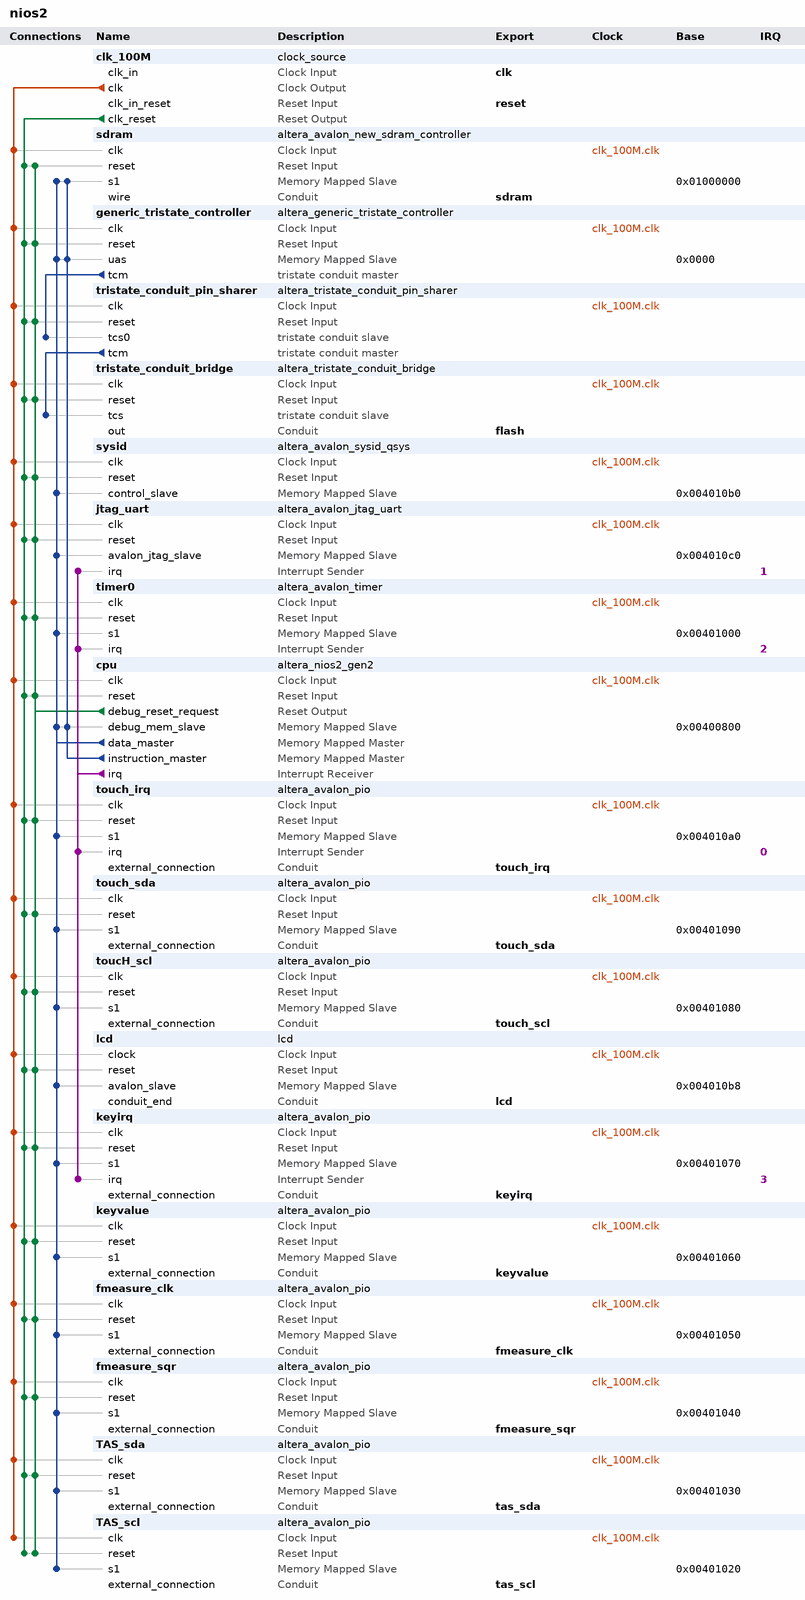
[diagram p0: system contents]
# Platform Designer (Qsys) system nios2, Cyclone IV E EP4CE40F23C8
# Parameters at their usual value, and those the tool derives, are not listed.
package require -exact qsys 17.0
create_system nios2
set_project_property DEVICE_FAMILY {Cyclone IV E}
set_project_property DEVICE EP4CE40F23C8

add_instance clk_100M clock_source 17.0
set_instance_parameter_value clk_100M clockFrequency 100000000

add_instance sdram altera_avalon_new_sdram_controller 17.0
set_instance_parameter_value sdram TAC 5.5
set_instance_parameter_value sdram TRCD 20.0
set_instance_parameter_value sdram TRP 20.0
set_instance_parameter_value sdram casLatency 3
set_instance_parameter_value sdram columnWidth 8
set_instance_parameter_value sdram dataWidth 16
set_instance_parameter_value sdram generateSimulationModel false
set_instance_parameter_value sdram model single_Micron_MT48LC4M32B2_7_chip
set_instance_parameter_value sdram numberOfBanks 4
set_instance_parameter_value sdram numberOfChipSelects 1
set_instance_parameter_value sdram powerUpDelay 100.0
set_instance_parameter_value sdram refreshPeriod 15.625
set_instance_parameter_value sdram rowWidth 12

add_instance generic_tristate_controller altera_generic_tristate_controller 17.0
set_instance_parameter_value generic_tristate_controller ACTIVE_LOW_BEGINTRANSFER 0
set_instance_parameter_value generic_tristate_controller ACTIVE_LOW_BYTEENABLE 0
set_instance_parameter_value generic_tristate_controller ACTIVE_LOW_OUTPUTENABLE 0
set_instance_parameter_value generic_tristate_controller ACTIVE_LOW_READ 1
set_instance_parameter_value generic_tristate_controller CHIPSELECT_THROUGH_READLATENCY 0
set_instance_parameter_value generic_tristate_controller INTERFACE_ASSIGNMENT_KEYS embeddedsw.configuration.isFlash,embeddedsw.configuration.isMemoryDevice,embeddedsw.configuration.isNonVolatileStorage
set_instance_parameter_value generic_tristate_controller INTERFACE_ASSIGNMENT_VALUES 1,1,1
set_instance_parameter_value generic_tristate_controller MODULE_ASSIGNMENT_KEYS embeddedsw.configuration.hwClassnameDriverSupportList,embeddedsw.configuration.hwClassnameDriverSupportDefault,embeddedsw.CMacro.SETUP_VALUE,embeddedsw.CMacro.WAIT_VALUE,embeddedsw.CMacro.HOLD_VALUE,embeddedsw.CMacro.TIMING_UNITS,embeddedsw.CMacro.SIZE,embeddedsw.memoryInfo.MEM_INIT_DATA_WIDTH,embeddedsw.memoryInfo.HAS_BYTE_LANE,embeddedsw.memoryInfo.IS_FLASH,embeddedsw.memoryInfo.GENERATE_DAT_SYM,embeddedsw.memoryInfo.GENERATE_FLASH,embeddedsw.memoryInfo.DAT_SYM_INSTALL_DIR,embeddedsw.memoryInfo.FLASH_INSTALL_DIR
set_instance_parameter_value generic_tristate_controller MODULE_ASSIGNMENT_VALUES altera_avalon_lan91c111:altera_avalon_cfi_flash,altera_avalon_cfi_flash,70,160,70,ns,4194304u,8,0,1,1,1,SIM_DIR,APP_DIR
set_instance_parameter_value generic_tristate_controller TCM_ADDRESS_W 22
set_instance_parameter_value generic_tristate_controller TCM_BYTEENABLE_W 1
set_instance_parameter_value generic_tristate_controller TCM_DATA_HOLD 70
set_instance_parameter_value generic_tristate_controller TCM_DATA_W 8
set_instance_parameter_value generic_tristate_controller TCM_MAX_PENDING_READ_TRANSACTIONS 3
set_instance_parameter_value generic_tristate_controller TCM_READLATENCY 2
set_instance_parameter_value generic_tristate_controller TCM_READ_WAIT 160
set_instance_parameter_value generic_tristate_controller TCM_SETUP_WAIT 70
set_instance_parameter_value generic_tristate_controller TCM_SYMBOLS_PER_WORD 1
set_instance_parameter_value generic_tristate_controller TCM_TIMING_UNITS 0
set_instance_parameter_value generic_tristate_controller TCM_TURNAROUND_TIME 2
set_instance_parameter_value generic_tristate_controller TCM_WRITE_WAIT 160
set_instance_parameter_value generic_tristate_controller USE_BEGINTRANSFER 0
set_instance_parameter_value generic_tristate_controller USE_BYTEENABLE 0
set_instance_parameter_value generic_tristate_controller USE_OUTPUTENABLE 0
set_instance_parameter_value generic_tristate_controller USE_READ 1

add_instance tristate_conduit_pin_sharer altera_tristate_conduit_pin_sharer 17.0
set_instance_parameter_value tristate_conduit_pin_sharer MODULE_ORIGIN_LIST generic_tristate_controller.tcm,generic_tristate_controller.tcm,generic_tristate_controller.tcm,generic_tristate_controller.tcm,generic_tristate_controller.tcm
set_instance_parameter_value tristate_conduit_pin_sharer NUM_INTERFACES 1

add_instance tristate_conduit_bridge altera_tristate_conduit_bridge 17.0

add_instance sysid altera_avalon_sysid_qsys 17.0
set_instance_parameter_value sysid id 0

add_instance jtag_uart altera_avalon_jtag_uart 17.0
set_instance_parameter_value jtag_uart simInteractiveOptions NO_INTERACTIVE_WINDOWS

add_instance timer0 altera_avalon_timer 17.0
set_instance_parameter_value timer0 fixedPeriod true
set_instance_parameter_value timer0 period 10
set_instance_parameter_value timer0 periodUnits MSEC
set_instance_parameter_value timer0 snapshot false

add_instance cpu altera_nios2_gen2 17.0
set_instance_parameter_value cpu dcache_size 0
set_instance_parameter_value cpu dividerType srt2
set_instance_parameter_value cpu exceptionSlave sdram.s1
set_instance_parameter_value cpu icache_size 8192
set_instance_parameter_value cpu impl Fast
set_instance_parameter_value cpu resetSlave generic_tristate_controller.uas

add_instance touch_irq altera_avalon_pio 17.0
set_instance_parameter_value touch_irq captureEdge true
set_instance_parameter_value touch_irq direction Input
set_instance_parameter_value touch_irq generateIRQ true
set_instance_parameter_value touch_irq irqType EDGE
set_instance_parameter_value touch_irq width 1

add_instance touch_sda altera_avalon_pio 17.0
set_instance_parameter_value touch_sda direction Bidir
set_instance_parameter_value touch_sda width 1

add_instance toucH_scl altera_avalon_pio 17.0
set_instance_parameter_value toucH_scl direction Output
set_instance_parameter_value toucH_scl width 1

add_instance lcd lcd 1.0

add_instance keyirq altera_avalon_pio 17.0
set_instance_parameter_value keyirq captureEdge true
set_instance_parameter_value keyirq direction Input
set_instance_parameter_value keyirq generateIRQ true
set_instance_parameter_value keyirq irqType EDGE
set_instance_parameter_value keyirq width 3

add_instance keyvalue altera_avalon_pio 17.0
set_instance_parameter_value keyvalue direction Input
set_instance_parameter_value keyvalue width 3

add_instance fmeasure_clk altera_avalon_pio 17.0
set_instance_parameter_value fmeasure_clk direction Input
set_instance_parameter_value fmeasure_clk width 32

add_instance fmeasure_sqr altera_avalon_pio 17.0
set_instance_parameter_value fmeasure_sqr direction Input
set_instance_parameter_value fmeasure_sqr width 32

add_instance TAS_sda altera_avalon_pio 17.0
set_instance_parameter_value TAS_sda direction Bidir
set_instance_parameter_value TAS_sda width 1

add_instance TAS_scl altera_avalon_pio 17.0
set_instance_parameter_value TAS_scl direction Output
set_instance_parameter_value TAS_scl width 1

# connections
add_connection clk_100M.clk cpu.clk clock
add_connection clk_100M.clk fmeasure_clk.clk clock
add_connection clk_100M.clk fmeasure_sqr.clk clock
add_connection clk_100M.clk generic_tristate_controller.clk clock
add_connection clk_100M.clk jtag_uart.clk clock
add_connection clk_100M.clk keyirq.clk clock
add_connection clk_100M.clk keyvalue.clk clock
add_connection clk_100M.clk lcd.clock clock
add_connection clk_100M.clk sdram.clk clock
add_connection clk_100M.clk sysid.clk clock
add_connection clk_100M.clk TAS_scl.clk clock
add_connection clk_100M.clk TAS_sda.clk clock
add_connection clk_100M.clk timer0.clk clock
add_connection clk_100M.clk touch_irq.clk clock
add_connection clk_100M.clk toucH_scl.clk clock
add_connection clk_100M.clk touch_sda.clk clock
add_connection clk_100M.clk tristate_conduit_bridge.clk clock
add_connection clk_100M.clk tristate_conduit_pin_sharer.clk clock
add_connection clk_100M.clk_reset cpu.reset reset
add_connection clk_100M.clk_reset fmeasure_clk.reset reset
add_connection clk_100M.clk_reset fmeasure_sqr.reset reset
add_connection clk_100M.clk_reset generic_tristate_controller.reset reset
add_connection clk_100M.clk_reset jtag_uart.reset reset
add_connection clk_100M.clk_reset keyirq.reset reset
add_connection clk_100M.clk_reset keyvalue.reset reset
add_connection clk_100M.clk_reset lcd.reset reset
add_connection clk_100M.clk_reset sdram.reset reset
add_connection clk_100M.clk_reset sysid.reset reset
add_connection clk_100M.clk_reset TAS_scl.reset reset
add_connection clk_100M.clk_reset TAS_sda.reset reset
add_connection clk_100M.clk_reset timer0.reset reset
add_connection clk_100M.clk_reset touch_irq.reset reset
add_connection clk_100M.clk_reset toucH_scl.reset reset
add_connection clk_100M.clk_reset touch_sda.reset reset
add_connection clk_100M.clk_reset tristate_conduit_bridge.reset reset
add_connection clk_100M.clk_reset tristate_conduit_pin_sharer.reset reset
add_connection cpu.debug_reset_request cpu.reset reset
add_connection cpu.debug_reset_request fmeasure_clk.reset reset
add_connection cpu.debug_reset_request fmeasure_sqr.reset reset
add_connection cpu.debug_reset_request generic_tristate_controller.reset reset
add_connection cpu.debug_reset_request jtag_uart.reset reset
add_connection cpu.debug_reset_request keyirq.reset reset
add_connection cpu.debug_reset_request keyvalue.reset reset
add_connection cpu.debug_reset_request lcd.reset reset
add_connection cpu.debug_reset_request sdram.reset reset
add_connection cpu.debug_reset_request sysid.reset reset
add_connection cpu.debug_reset_request TAS_scl.reset reset
add_connection cpu.debug_reset_request TAS_sda.reset reset
add_connection cpu.debug_reset_request timer0.reset reset
add_connection cpu.debug_reset_request touch_irq.reset reset
add_connection cpu.debug_reset_request toucH_scl.reset reset
add_connection cpu.debug_reset_request touch_sda.reset reset
add_connection cpu.debug_reset_request tristate_conduit_bridge.reset reset
add_connection cpu.debug_reset_request tristate_conduit_pin_sharer.reset reset
add_connection cpu.data_master cpu.debug_mem_slave avalon
set_connection_parameter_value cpu.data_master/cpu.debug_mem_slave baseAddress 0x00400800
add_connection cpu.data_master fmeasure_clk.s1 avalon
set_connection_parameter_value cpu.data_master/fmeasure_clk.s1 baseAddress 0x00401050
add_connection cpu.data_master fmeasure_sqr.s1 avalon
set_connection_parameter_value cpu.data_master/fmeasure_sqr.s1 baseAddress 0x00401040
add_connection cpu.data_master generic_tristate_controller.uas avalon
set_connection_parameter_value cpu.data_master/generic_tristate_controller.uas baseAddress 0x0000
add_connection cpu.data_master jtag_uart.avalon_jtag_slave avalon
set_connection_parameter_value cpu.data_master/jtag_uart.avalon_jtag_slave baseAddress 0x004010c0
add_connection cpu.data_master keyirq.s1 avalon
set_connection_parameter_value cpu.data_master/keyirq.s1 baseAddress 0x00401070
add_connection cpu.data_master keyvalue.s1 avalon
set_connection_parameter_value cpu.data_master/keyvalue.s1 baseAddress 0x00401060
add_connection cpu.data_master lcd.avalon_slave avalon
set_connection_parameter_value cpu.data_master/lcd.avalon_slave baseAddress 0x004010b8
add_connection cpu.data_master sdram.s1 avalon
set_connection_parameter_value cpu.data_master/sdram.s1 baseAddress 0x01000000
add_connection cpu.data_master sysid.control_slave avalon
set_connection_parameter_value cpu.data_master/sysid.control_slave baseAddress 0x004010b0
add_connection cpu.data_master TAS_scl.s1 avalon
set_connection_parameter_value cpu.data_master/TAS_scl.s1 baseAddress 0x00401020
add_connection cpu.data_master TAS_sda.s1 avalon
set_connection_parameter_value cpu.data_master/TAS_sda.s1 baseAddress 0x00401030
add_connection cpu.data_master timer0.s1 avalon
set_connection_parameter_value cpu.data_master/timer0.s1 baseAddress 0x00401000
add_connection cpu.data_master touch_irq.s1 avalon
set_connection_parameter_value cpu.data_master/touch_irq.s1 baseAddress 0x004010a0
add_connection cpu.data_master toucH_scl.s1 avalon
set_connection_parameter_value cpu.data_master/toucH_scl.s1 baseAddress 0x00401080
add_connection cpu.data_master touch_sda.s1 avalon
set_connection_parameter_value cpu.data_master/touch_sda.s1 baseAddress 0x00401090
add_connection cpu.instruction_master cpu.debug_mem_slave avalon
set_connection_parameter_value cpu.instruction_master/cpu.debug_mem_slave baseAddress 0x00400800
add_connection cpu.instruction_master generic_tristate_controller.uas avalon
set_connection_parameter_value cpu.instruction_master/generic_tristate_controller.uas baseAddress 0x0000
add_connection cpu.instruction_master sdram.s1 avalon
set_connection_parameter_value cpu.instruction_master/sdram.s1 baseAddress 0x01000000
add_connection cpu.irq jtag_uart.irq interrupt
set_connection_parameter_value cpu.irq/jtag_uart.irq irqNumber 1
add_connection cpu.irq keyirq.irq interrupt
set_connection_parameter_value cpu.irq/keyirq.irq irqNumber 3
add_connection cpu.irq timer0.irq interrupt
set_connection_parameter_value cpu.irq/timer0.irq irqNumber 2
add_connection cpu.irq touch_irq.irq interrupt
set_connection_parameter_value cpu.irq/touch_irq.irq irqNumber 0
add_connection generic_tristate_controller.tcm tristate_conduit_pin_sharer.tcs0 tristate_conduit
add_connection tristate_conduit_pin_sharer.tcm tristate_conduit_bridge.tcs tristate_conduit

# exported interfaces
add_interface clk clock sink
set_interface_property clk EXPORT_OF clk_100M.clk_in
add_interface flash conduit end
set_interface_property flash EXPORT_OF tristate_conduit_bridge.out
add_interface fmeasure_clk conduit end
set_interface_property fmeasure_clk EXPORT_OF fmeasure_clk.external_connection
add_interface fmeasure_sqr conduit end
set_interface_property fmeasure_sqr EXPORT_OF fmeasure_sqr.external_connection
add_interface keyirq conduit end
set_interface_property keyirq EXPORT_OF keyirq.external_connection
add_interface keyvalue conduit end
set_interface_property keyvalue EXPORT_OF keyvalue.external_connection
add_interface lcd conduit end
set_interface_property lcd EXPORT_OF lcd.conduit_end
add_interface reset reset sink
set_interface_property reset EXPORT_OF clk_100M.clk_in_reset
add_interface sdram conduit end
set_interface_property sdram EXPORT_OF sdram.wire
add_interface tas_scl conduit end
set_interface_property tas_scl EXPORT_OF TAS_scl.external_connection
add_interface tas_sda conduit end
set_interface_property tas_sda EXPORT_OF TAS_sda.external_connection
add_interface touch_irq conduit end
set_interface_property touch_irq EXPORT_OF touch_irq.external_connection
add_interface touch_scl conduit end
set_interface_property touch_scl EXPORT_OF toucH_scl.external_connection
add_interface touch_sda conduit end
set_interface_property touch_sda EXPORT_OF touch_sda.external_connection

set_interconnect_requirement {$system} qsys_mm.clockCrossingAdapter HANDSHAKE
set_interconnect_requirement {$system} qsys_mm.maxAdditionalLatency 1

save_system nios2.qsys
